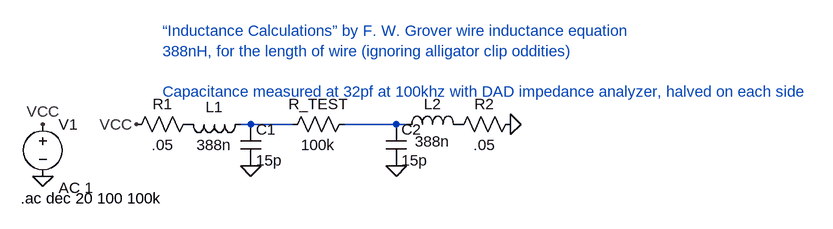
[diagram p0: schematic Resistor Leads.asc]
Resistor Leads.asc, the LTspice schematic file:
Version 4
SHEET 1 880 680
WIRE 128 128 112 128
WIRE 192 128 128 128
WIRE 352 128 272 128
WIRE 368 128 352 128
FLAG 528 128 0
FLAG -192 208 0
FLAG -192 128 VCC
FLAG -48 128 VCC
FLAG 128 192 0
FLAG 352 192 0
SYMBOL ind 128 112 R90
WINDOW 0 5 56 VBottom 2
WINDOW 3 32 56 VTop 2
SYMATTR InstName L1
SYMATTR Value 388n
SYMBOL res 48 112 R90
WINDOW 0 0 56 VBottom 2
WINDOW 3 32 56 VTop 2
SYMATTR InstName R1
SYMATTR Value .05
SYMBOL ind 352 144 R270
WINDOW 0 32 56 VTop 2
WINDOW 3 5 56 VBottom 2
SYMATTR InstName L2
SYMATTR Value 388n
SYMBOL res 432 144 R270
WINDOW 0 32 56 VTop 2
WINDOW 3 0 56 VBottom 2
SYMATTR InstName R2
SYMATTR Value .05
SYMBOL res 288 112 R90
WINDOW 0 0 56 VBottom 2
WINDOW 3 32 56 VTop 2
SYMATTR InstName R_TEST
SYMATTR Value 100k
SYMBOL voltage -192 112 R0
WINDOW 123 24 114 Left 2
WINDOW 39 0 0 Left 0
SYMATTR InstName V1
SYMATTR Value ""
SYMATTR Value2 AC 1
SYMBOL cap 112 128 R0
SYMATTR InstName C1
SYMATTR Value 15p
SYMBOL cap 336 128 R0
SYMATTR InstName C2
SYMATTR Value 15p
TEXT -8 -16 Left 2 ;“Inductance Calculations” by F. W. Grover wire inductance equation\n388nH, for the length of wire (ignoring alligator clip oddities)\n \nCapacitance measured at 32pf at 100khz with DAD impedance analyzer, halved on each side
TEXT -226 242 Left 2 !.ac dec 20 100 100k

The netlist it stands for:
* Resistor Leads.asc
L1 N001 P001 388n
R1 P001 VCC .05
L2 N002 P002 388n
R2 P002 0 .05
R_TEST N002 N001 100k
V1 VCC 0 AC 1
C1 N001 0 15p
C2 N002 0 15p
* “Inductance Calculations” by F. W. Grover wire inductance equation
* 388nH, for the length of wire (ignoring alligator clip oddities)
* Capacitance measured at 32pf at 100khz with DAD impedance analyzer, halved on each side
.ac dec 20 100 100k
.backanno
.end